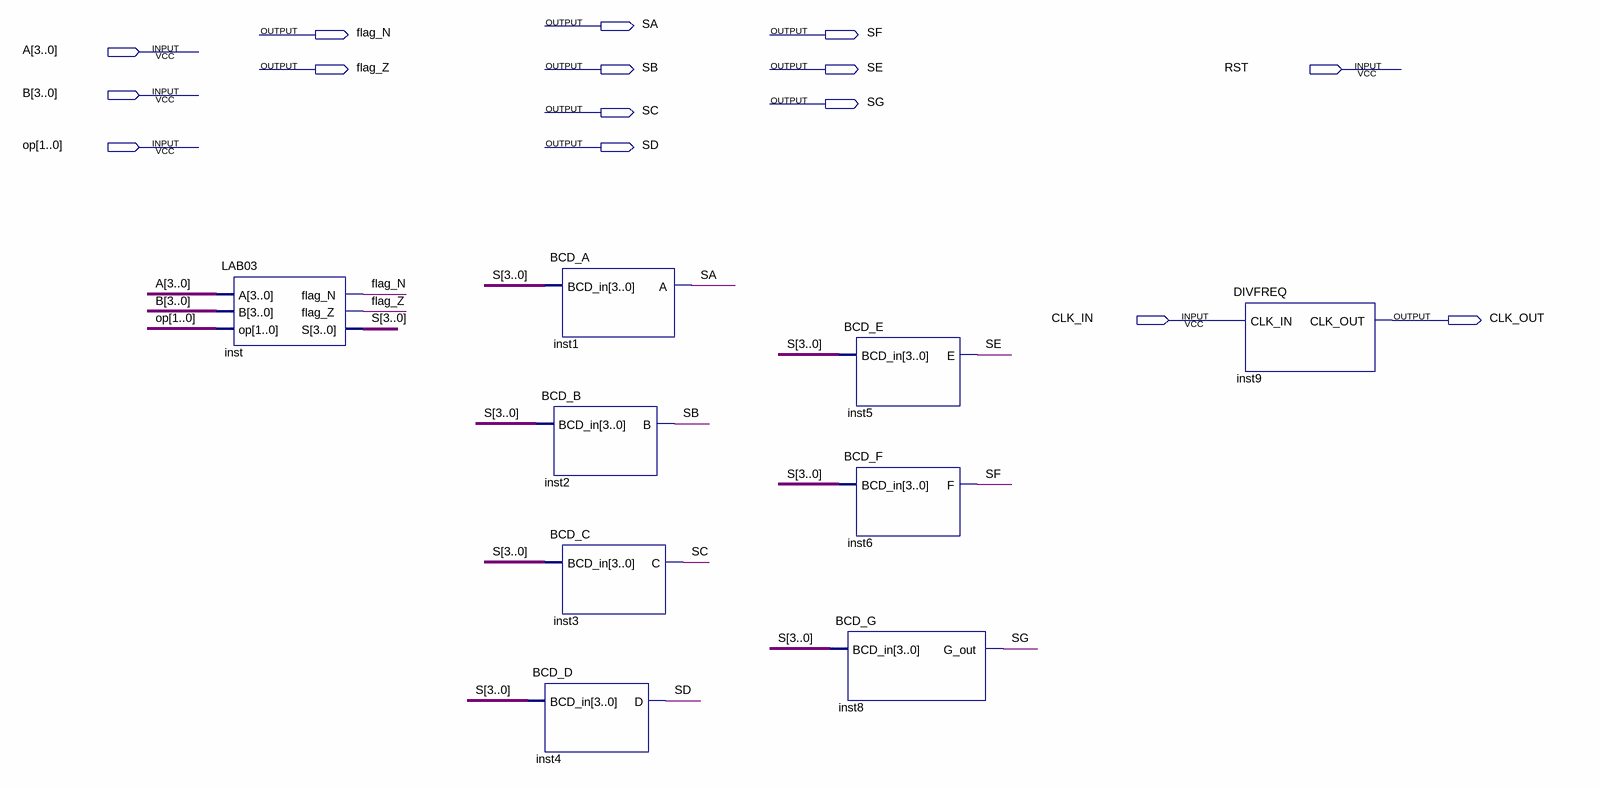
[diagram p0: schematic sheet]
// Quartus schematic ConversorBCD.bdf as structural Verilog: 9 symbols, 15 pins
module ConversorBCD (
  input  [3:0] A,
  input  RST,
  input  [3:0] B,
  input  [1:0] op,
  input  CLK_IN,
  output SA,
  output flag_N,
  output SF,
  output flag_Z,
  output SB,
  output SE,
  output SG,
  output SC,
  output SD,
  output CLK_OUT
);

  wire [3:0] S;

  LAB03 inst (.A(A), .B(B), .op(op), .flag_N(flag_N), .flag_Z(flag_Z), .S(S));
  BCD_D inst4 (.BCD_in(S), .D(SD));
  BCD_A inst1 (.BCD_in(S), .A(SA));
  BCD_B inst2 (.BCD_in(S), .B(SB));
  BCD_C inst3 (.BCD_in(S), .C(SC));
  BCD_E inst5 (.BCD_in(S), .E(SE));
  BCD_F inst6 (.BCD_in(S), .F(SF));
  BCD_G inst8 (.BCD_in(S), .G_out(SG));
  DIVFREQ inst9 (.CLK_IN(CLK_IN), .CLK_OUT(CLK_OUT));
endmodule
